# EAGLE design TeensyAmp_R4.2b (EAGLE 9.6.2)

## Sheet 1 of 3
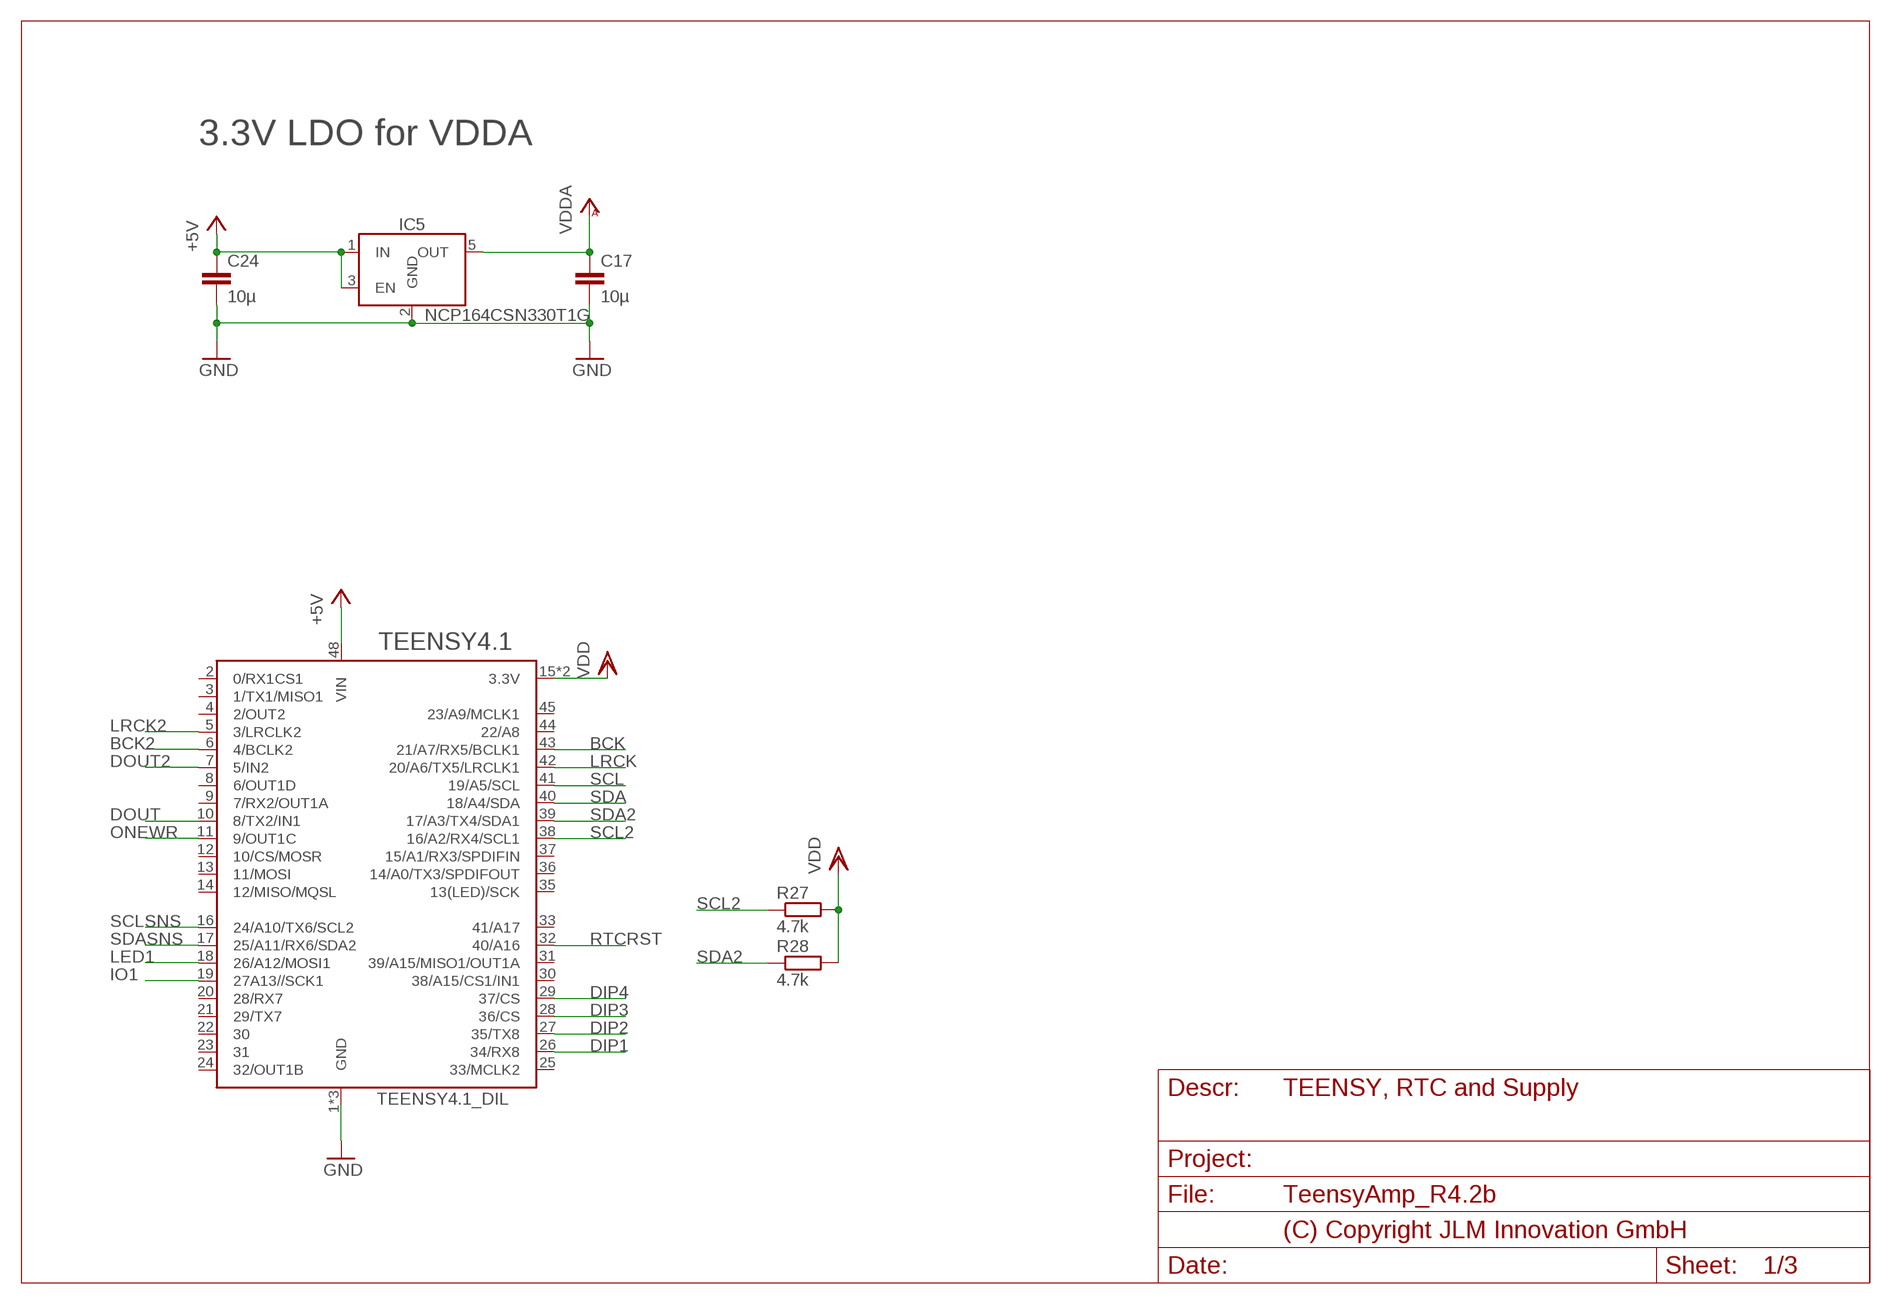
[diagram p0: schematic, sheet 1]
FRAME2 (DINA4_L): PAGE_DESCRIPTION: TEENSY, RTC and Supply

### Parts
C17  10µ  C-EUC0603  [C0603]
C24  10µ  C-EUC0603  [C0603]
IC5  NCP164CSN330T1G  LDO_ENSOT23-5  [SOT23-5]
R27  4.7k  R_JLMR0603  [R0603]
R28  4.7k  R_JLMR0603  [R0603]
TEENSY4.1  TEENSY4.1_DIL  [TEENSY4.1_DIL]

### Nets
+5V: C24.1 IC5.1(IN) IC5.3(EN) TEENSY4.1.48(VIN)
BCK: TEENSY4.1.43(21/A7/RX5/BCLK1)
BCK2: TEENSY4.1.6(4/BCLK2) ; also sheet 2,3
DIP1: TEENSY4.1.26(34/RX8)
DIP2: TEENSY4.1.27(35/TX8)
DIP3: TEENSY4.1.28(36/CS)
DIP4: TEENSY4.1.29(37/CS)
DOUT: TEENSY4.1.10(8/TX2/IN1)
DOUT2: TEENSY4.1.7(5/IN2) ; also sheet 2,3
GND: C17.2 C24.2 IC5.2(GND) TEENSY4.1.1(GND) TEENSY4.1.34(GND) TEENSY4.1.47(GND) ; also sheet 2,3
IO1: TEENSY4.1.19(27A13//SCK1)
LED1: TEENSY4.1.18(26/A12/MOSI1)
LRCK: TEENSY4.1.42(20/A6/TX5/LRCLK1)
LRCK2: TEENSY4.1.5(3/LRCLK2) ; also sheet 2,3
ONEWR: TEENSY4.1.11(9/OUT1C)
RTCRST: TEENSY4.1.32(40/A16)
SCL: TEENSY4.1.41(19/A5/SCL)
SCL2: R27.1 TEENSY4.1.38(16/A2/RX4/SCL1) ; also sheet 2,3
SCLSNS: TEENSY4.1.16(24/A10/TX6/SCL2)
SDA: TEENSY4.1.40(18/A4/SDA)
SDA2: R28.1 TEENSY4.1.39(17/A3/TX4/SDA1) ; also sheet 2,3
SDASNS: TEENSY4.1.17(25/A11/RX6/SDA2)
VDD: R27.2 R28.2 TEENSY4.1.15(3.3V) TEENSY4.1.46(3.3V) ; also sheet 2,3
VDDA: C17.1 IC5.5(OUT) ; also sheet 2,3
Unconnected: TEENSY4.1.2(0/RX1CS1) TEENSY4.1.3(1/TX1/MISO1) TEENSY4.1.4(2/OUT2) TEENSY4.1.8(6/OUT1D) TEENSY4.1.9(7/RX2/OUT1A) TEENSY4.1.12(10/CS/MOSR) TEENSY4.1.13(11/MOSI) TEENSY4.1.14(12/MISO/MQSL) TEENSY4.1.20(28/RX7) TEENSY4.1.21(29/TX7) TEENSY4.1.22 TEENSY4.1.23 TEENSY4.1.24(32/OUT1B) TEENSY4.1.25(33/MCLK2) TEENSY4.1.30(38/A15/CS1/IN1) TEENSY4.1.31(39/A15/MISO1/OUT1A) TEENSY4.1.33(41/A17) TEENSY4.1.35(13(LED)/SCK) TEENSY4.1.36(14/A0/TX3/SPDIFOUT) TEENSY4.1.37(15/A1/RX3/SPDIFIN) TEENSY4.1.44(22/A8) TEENSY4.1.45(23/A9/MCLK1)

### Notes on the sheet
- 3.3V LDO for VDDA

## Sheet 2 of 3
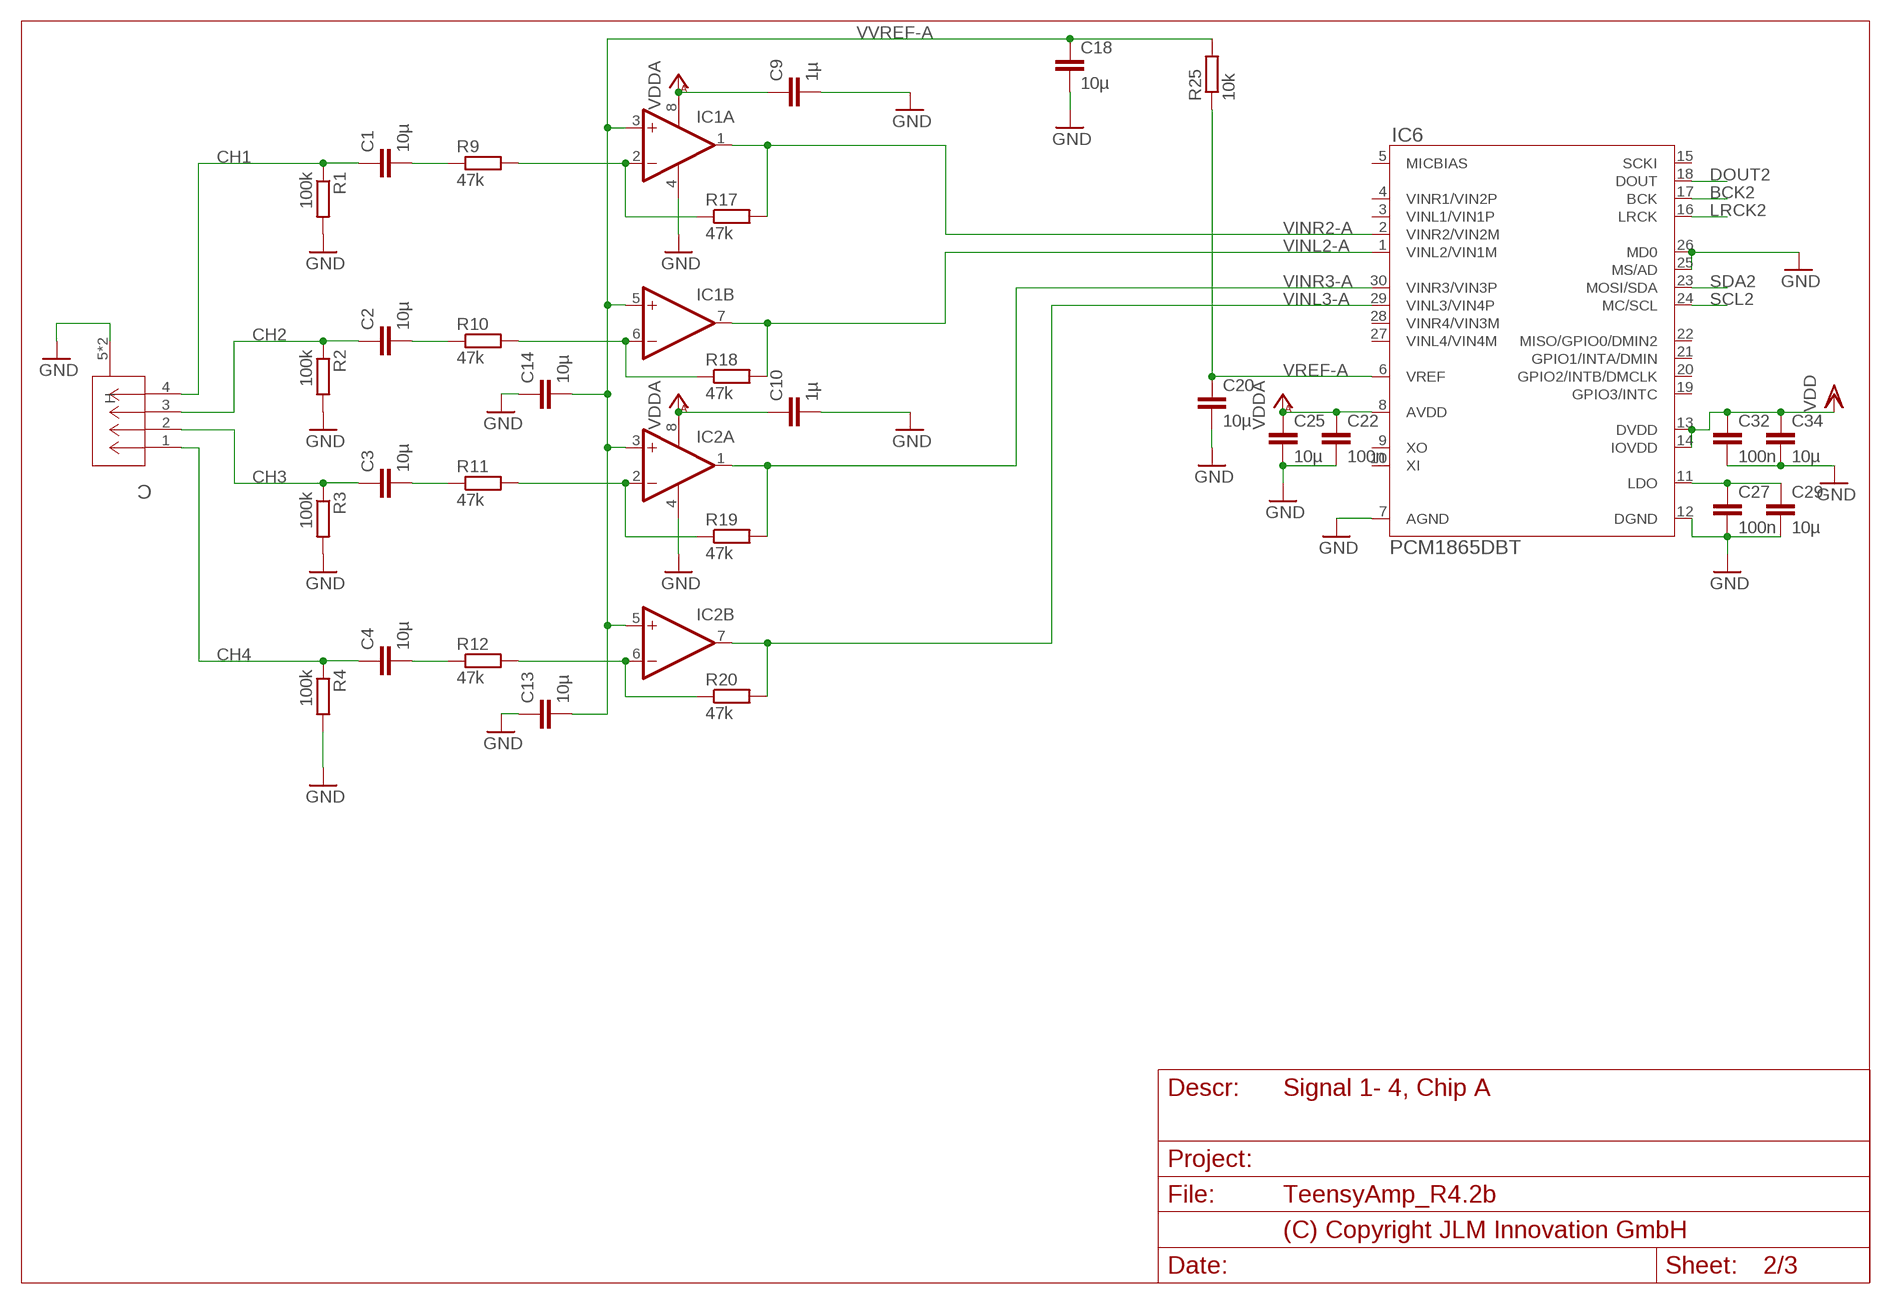
[diagram p1: schematic, sheet 2]
FRAME1 (DINA4_L): PAGE_DESCRIPTION: Signal 1- 4, Chip A

### Parts
C  5055670471  [CONN04_5055670471_MOL]
C1  10µ  C-EUC0805  [C0805]
C2  10µ  C-EUC0805  [C0805]
C3  10µ  C-EUC0805  [C0805]
C4  10µ  C-EUC0805  [C0805]
C9  1µ  C-EUC0603  [C0603]
C10  1µ  C-EUC0603  [C0603]
C13  10µ  C-EUC0603  [C0603]
C14  10µ  C-EUC0603  [C0603]
C18  10µ  C-EUC0603  [C0603]
C20  10µ  C-EUC0603  [C0603]
C22  100n  C-EUC0603  [C0603]
C25  10µ  C-EUC0603  [C0603]
C27  100n  C-EUC0603  [C0603]
C29  10µ  C-EUC0603  [C0603]
C32  100n  C-EUC0603  [C0603]
C34  10µ  C-EUC0603  [C0603]
IC1  OPA2344E  [MSOP08]
IC2  OPA2344E  [MSOP08]
IC6  PCM1865DBT  [SOP50P640X120-30N]
R1  100k  R_JLMR0603  [R0603]
R2  100k  R_JLMR0603  [R0603]
R3  100k  R_JLMR0603  [R0603]
R4  100k  R_JLMR0603  [R0603]
R9  47k  R_JLMR0603  [R0603]
R10  47k  R_JLMR0603  [R0603]
R11  47k  R_JLMR0603  [R0603]
R12  47k  R_JLMR0603  [R0603]
R17  47k  R_JLMR0603  [R0603]
R18  47k  R_JLMR0603  [R0603]
R19  47k  R_JLMR0603  [R0603]
R20  47k  R_JLMR0603  [R0603]
R25  10k  R_JLMR0603  [R0603]

### Nets
BCK2: IC6.17(BCK) ; also sheet 1,3
CH1: C1.1 C.4 R1.1
CH2: C2.1 C.3 R2.1
CH3: C3.1 C.2 R3.1
CH4: C4.1 C.1 R4.1
DOUT2: IC6.18(DOUT) ; also sheet 1,3
GND: C9.2 C10.2 C13.1 C14.1 C18.2 C20.2 C22.2 C25.2 C27.2 C29.2 C32.2 C34.2 C.5(H) C.6(H) IC1.4(A:V-) IC2.4(A:V-) IC6.7(AGND) IC6.12(DGND) IC6.25(MS/AD) IC6.26(MD0) R1.2 R2.2 R3.2 R4.2 ; also sheet 1,3
LRCK2: IC6.16(LRCK) ; also sheet 1,3
N$11: C27.1 C29.1 IC6.11(LDO)
N$23: C2.2 R10.1
N$24: C3.2 R11.1
N$25: C1.2 R9.1
N$26: C4.2 R12.1
N$31: IC1.2(A:-IN) R9.2 R17.1
N$32: IC1.6(B:-IN) R10.2 R18.1
N$33: IC2.2(A:-IN) R11.2 R19.1
N$34: IC2.6(B:-IN) R12.2 R20.1
SCL2: IC6.24(MC/SCL) ; also sheet 1,3
SDA2: IC6.23(MOSI/SDA) ; also sheet 1,3
VDD: C32.1 C34.1 IC6.13(DVDD) IC6.14(IOVDD) ; also sheet 1,3
VDDA: C9.1 C10.1 C22.1 C25.1 IC1.8(A:V+) IC2.8(A:V+) IC6.8(AVDD) ; also sheet 1,3
VINL2-A: IC1.7(B:OUT) IC6.1(VINL2/VIN1M) R18.2
VINL3-A: IC2.7(B:OUT) IC6.29(VINL3/VIN4P) R20.2
VINR2-A: IC1.1(A:OUT) IC6.2(VINR2/VIN2M) R17.2
VINR3-A: IC2.1(A:OUT) IC6.30(VINR3/VIN3P) R19.2
VREF-A: C20.1 IC6.6(VREF) R25.1
VVREF-A: C13.2 C14.2 C18.1 IC1.3(A:+IN) IC1.5(B:+IN) IC2.3(A:+IN) IC2.5(B:+IN) R25.2
Unconnected: IC6.3(VINL1/VIN1P) IC6.4(VINR1/VIN2P) IC6.5(MICBIAS) IC6.9(XO) IC6.10(XI) IC6.15(SCKI) IC6.19(GPIO3/INTC) IC6.20(GPIO2/INTB/DMCLK) IC6.21(GPIO1/INTA/DMIN) IC6.22(MISO/GPIO0/DMIN2) IC6.27(VINL4/VIN4M) IC6.28(VINR4/VIN3M)

## Sheet 3 of 3
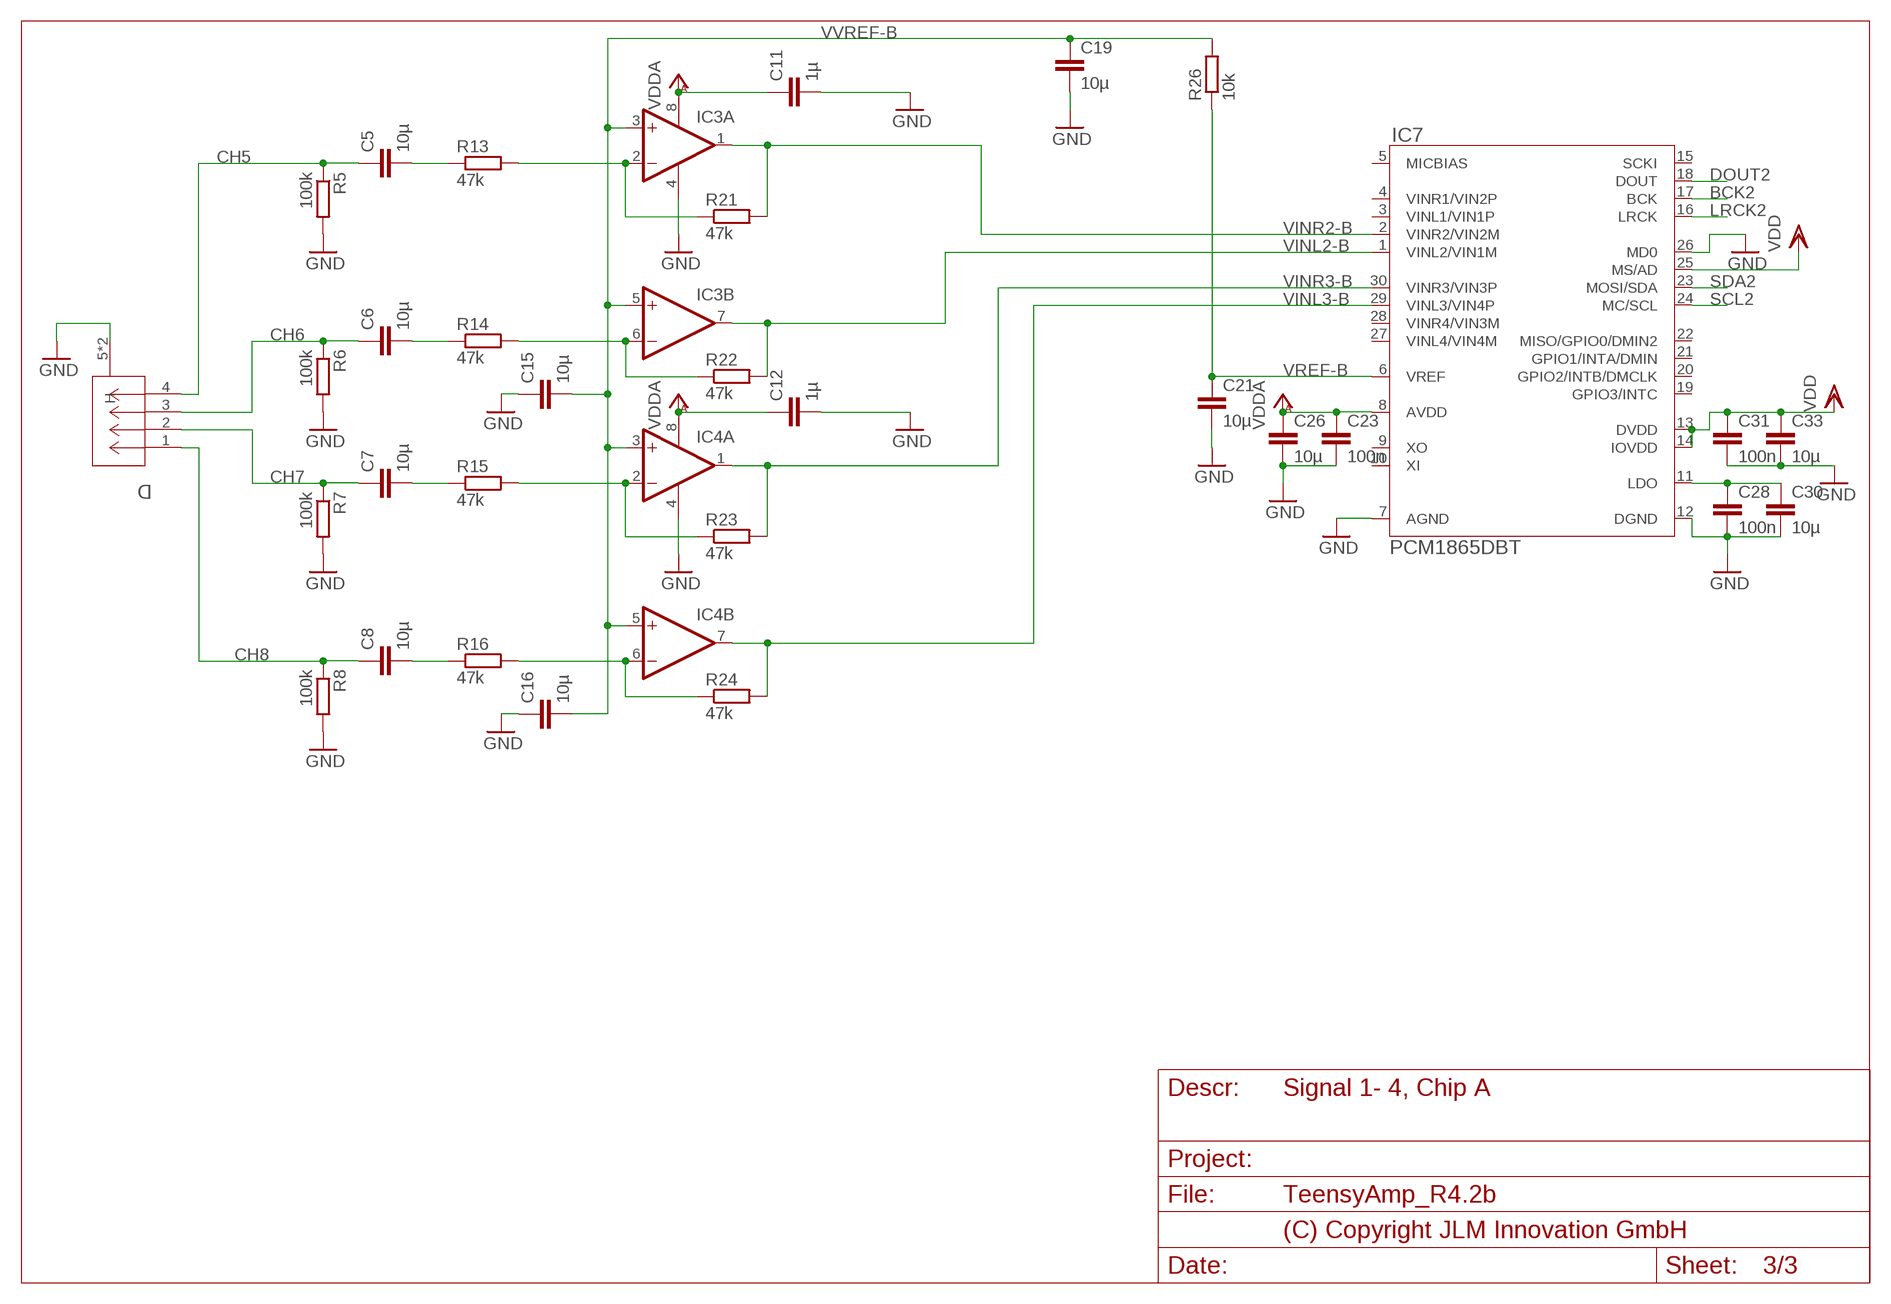
[diagram p2: schematic, sheet 3]
FRAME3 (DINA4_L): PAGE_DESCRIPTION: Signal 1- 4, Chip A

### Parts
C5  10µ  C-EUC0805  [C0805]
C6  10µ  C-EUC0805  [C0805]
C7  10µ  C-EUC0805  [C0805]
C8  10µ  C-EUC0805  [C0805]
C11  1µ  C-EUC0603  [C0603]
C12  1µ  C-EUC0603  [C0603]
C15  10µ  C-EUC0603  [C0603]
C16  10µ  C-EUC0603  [C0603]
C19  10µ  C-EUC0603  [C0603]
C21  10µ  C-EUC0603  [C0603]
C23  100n  C-EUC0603  [C0603]
C26  10µ  C-EUC0603  [C0603]
C28  100n  C-EUC0603  [C0603]
C30  10µ  C-EUC0603  [C0603]
C31  100n  C-EUC0603  [C0603]
C33  10µ  C-EUC0603  [C0603]
D  5055670471  [CONN04_5055670471_MOL]
IC3  OPA2344E  [MSOP08]
IC4  OPA2344E  [MSOP08]
IC7  PCM1865DBT  [SOP50P640X120-30N]
R5  100k  R_JLMR0603  [R0603]
R6  100k  R_JLMR0603  [R0603]
R7  100k  R_JLMR0603  [R0603]
R8  100k  R_JLMR0603  [R0603]
R13  47k  R_JLMR0603  [R0603]
R14  47k  R_JLMR0603  [R0603]
R15  47k  R_JLMR0603  [R0603]
R16  47k  R_JLMR0603  [R0603]
R21  47k  R_JLMR0603  [R0603]
R22  47k  R_JLMR0603  [R0603]
R23  47k  R_JLMR0603  [R0603]
R24  47k  R_JLMR0603  [R0603]
R26  10k  R_JLMR0603  [R0603]

### Nets
BCK2: IC7.17(BCK) ; also sheet 1,2
CH5: C5.1 D.4 R5.1
CH6: C6.1 D.3 R6.1
CH7: C7.1 D.2 R7.1
CH8: C8.1 D.1 R8.1
DOUT2: IC7.18(DOUT) ; also sheet 1,2
GND: C11.2 C12.2 C15.1 C16.1 C19.2 C21.2 C23.2 C26.2 C28.2 C30.2 C31.2 C33.2 D.5(H) D.6(H) IC3.4(A:V-) IC4.4(A:V-) IC7.7(AGND) IC7.12(DGND) IC7.26(MD0) R5.2 R6.2 R7.2 R8.2 ; also sheet 1,2
LRCK2: IC7.16(LRCK) ; also sheet 1,2
N$43: C28.1 C30.1 IC7.11(LDO)
N$48: IC3.2(A:-IN) R13.2 R21.1
N$49: IC3.6(B:-IN) R14.2 R22.1
N$50: IC4.2(A:-IN) R15.2 R23.1
N$51: IC4.6(B:-IN) R16.2 R24.1
N$52: C6.2 R14.1
N$53: C7.2 R15.1
N$54: C8.2 R16.1
N$55: C5.2 R13.1
SCL2: IC7.24(MC/SCL) ; also sheet 1,2
SDA2: IC7.23(MOSI/SDA) ; also sheet 1,2
VDD: C31.1 C33.1 IC7.13(DVDD) IC7.14(IOVDD) IC7.25(MS/AD) ; also sheet 1,2
VDDA: C11.1 C12.1 C23.1 C26.1 IC3.8(A:V+) IC4.8(A:V+) IC7.8(AVDD) ; also sheet 1,2
VINL2-B: IC3.7(B:OUT) IC7.1(VINL2/VIN1M) R22.2
VINL3-B: IC4.7(B:OUT) IC7.29(VINL3/VIN4P) R24.2
VINR2-B: IC3.1(A:OUT) IC7.2(VINR2/VIN2M) R21.2
VINR3-B: IC4.1(A:OUT) IC7.30(VINR3/VIN3P) R23.2
VREF-B: C21.1 IC7.6(VREF) R26.1
VVREF-B: C15.2 C16.2 C19.1 IC3.3(A:+IN) IC3.5(B:+IN) IC4.3(A:+IN) IC4.5(B:+IN) R26.2
Unconnected: IC7.3(VINL1/VIN1P) IC7.4(VINR1/VIN2P) IC7.5(MICBIAS) IC7.9(XO) IC7.10(XI) IC7.15(SCKI) IC7.19(GPIO3/INTC) IC7.20(GPIO2/INTB/DMCLK) IC7.21(GPIO1/INTA/DMIN) IC7.22(MISO/GPIO0/DMIN2) IC7.27(VINL4/VIN4M) IC7.28(VINR4/VIN3M)

## Library data of the parts
C D = teensyamp:5055670471: molex micro-lock plus horizontal header 4 pins; COPYRIGHT: Copyright (C) 2025 Ultra Librarian. All rights reserved.; MANUFACTURER_PART_NUMBER: 5055670471; MFR_NAME: Molex Connector Corporation
C1-C34 = jlm_cap:C-EU: CAPACITOR, European symbol
IC1-IC4 = jlm_linear:OPA2*: Dual Operational Amplifier Low Power, Single-Supply, Rail-To-Rail Operational Amplifier Source: http://focus.ti.com/lit/ds/symlink/opa2345.pdf http://focus.ti.com .. opa241.pdf http://focus.ti.com/lit/ds/symlink/opa2134.pdf
IC5 = jlm_power:LDO_EN; OC_FARNELL: 3367831; OC_MOUSER: 863-NCP164CSN330T1G
IC6 IC7 = jlm_adc_dac:PCM1865: PCM1865 4-Channel, 192-kHz, Audio ADCs; OC_MOUSER: 595-PCM1865DBT
R1-R28 = jlm_resistors:R_JLM: RESISTOR, European symbol
TEENSY4.1 = jlm_micro:TEENSY4.1_DIL

## Net classes
0 default: clearance 0.205 mm

## Board
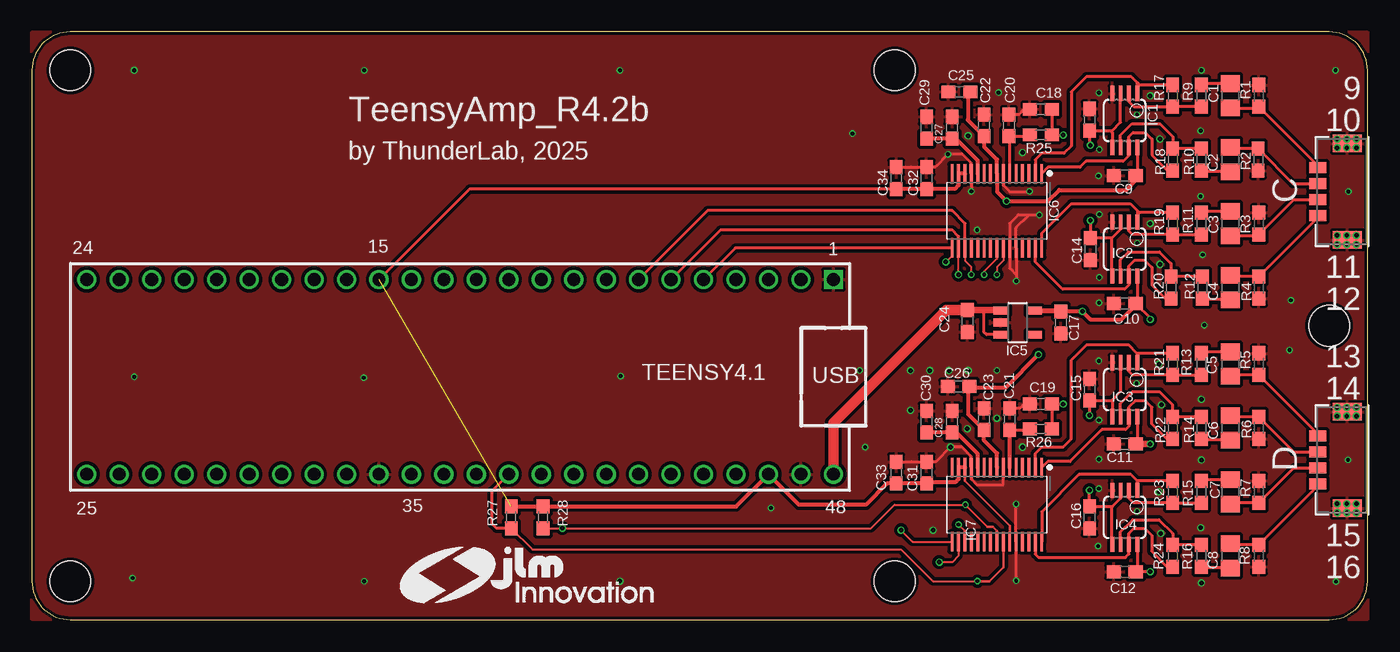
[diagram p3: board, top side]
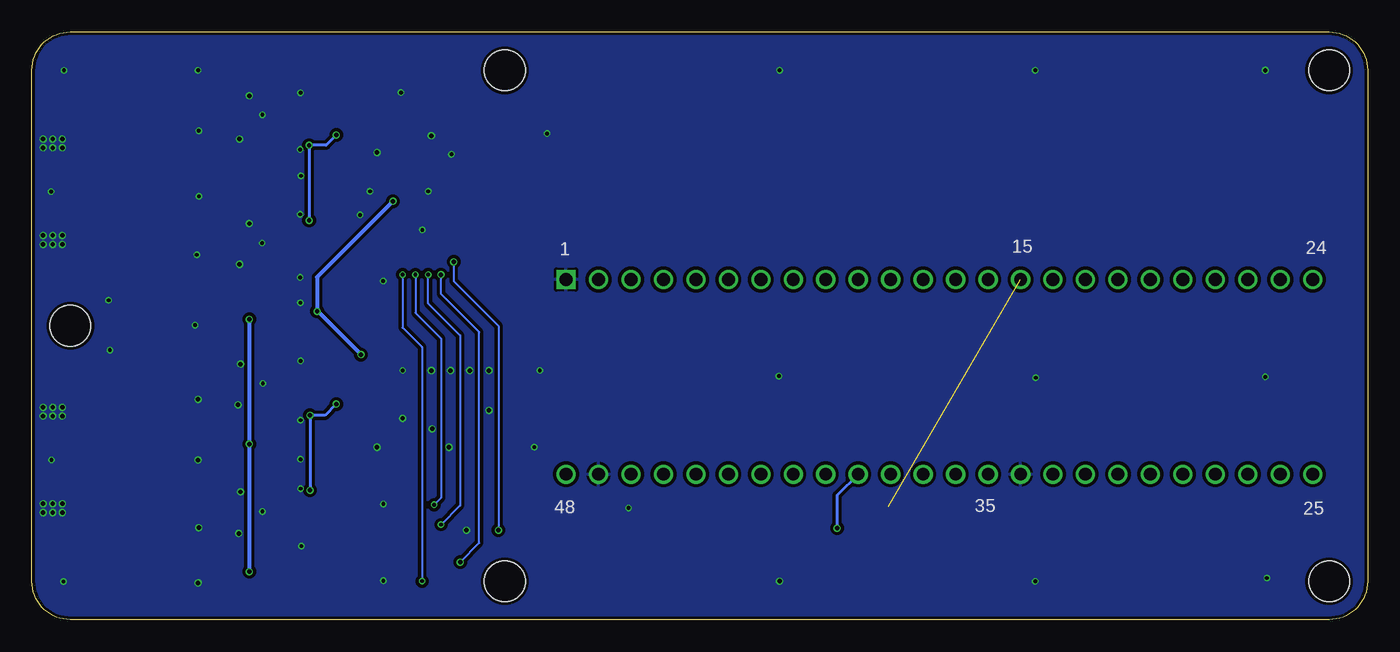
[diagram p4: board, bottom side, seen from below]

Size 104.5 x 46 mm. Coordinates in mm from the lower left corner, seen from the top.
Outline: 50.5,0 3,0 arc-90 0,3 0,43 arc-90 3,46 101.5,46 arc-90 104.5,43 104.5,3 arc-90 101.5,0 64.5,0
Outline: 50.5,0 50.59,0
Outline: 64.41,0 64.5,0
Outline: 50.5,0 64.5,0
Copper layers (1*16): Top 0.018mm / dielectric 1.55mm / Bottom 0.018mm
Design rules "Multi-CB_2L_100цm-Tracks_OL35цm *": minimum track width 0.1mm, minimum drill 0.2mm, track to track 0.1mm, track to pad 0.1mm, pad to pad 0.1mm, via to via 0.1mm, smd to smd 0mil, copper to edge 0.2mm, drill to drill 0.2mm, minimum pad ring 0.125mm, minimum via ring 0.1mm, stop-mask expansion 2mil, vias tented up to drill 0mil, thermal gap 0.2mm
Holes 3.2 mm at 3,3 67.5,3 3,43 67.5,43 101.5,23

### Footprints (pad centres in the part's own frame; a part is rotated, then mirrored left to right if it is on the bottom)
CONN04_5055670471_MOL = smd 0.838 x 1.295: 1 1.875,-1.894; 2 0.625,-1.894; 3 -0.625,-1.894; 4 -1.875,-1.894 | smd 1.397 x 2.261: 5 -3.775,0.401; 6 3.775,0.401
C0805 = smd 1.3 x 1.5: 1 -0.95,0; 2 0.95,0
C0603 = smd 1.1 x 1: 1 -0.85,0; 2 0.85,0
MSOP08 = smd 0.3 x 1.2: 1 -0.976,-2.113; 2 -0.326,-2.113; 3 0.324,-2.113; 4 0.974,-2.113; 5 0.974,2.112; 6 0.324,2.112; 7 -0.326,2.112; 8 -0.976,2.112
SOT23-5 = smd 0.6 x 1.2: 1 -0.95,-1.306; 2 0,-1.306; 3 0.95,-1.306; 4 0.95,1.306; 5 -0.95,1.306
SOP50P640X120-30N = smd 1.5 x 0.28: 1 -2.9,3.5; 2 -2.9,3; 3 -2.9,2.5; 4 -2.9,2; 5 -2.9,1.5; 6 -2.9,1; 7 -2.9,0.5; 8 -2.9,0; 9 -2.9,-0.5; 10 -2.9,-1; 11 -2.9,-1.5; 12 -2.9,-2; 13 -2.9,-2.5; 14 -2.9,-3; 15 -2.9,-3.5; 16 2.9,-3.5; 17 2.9,-3; 18 2.9,-2.5; 19 2.9,-2; 20 2.9,-1.5; 21 2.9,-1; 22 2.9,-0.5; 23 2.9,0; 24 2.9,0.5; 25 2.9,1; 26 2.9,1.5; 27 2.9,2; 28 2.9,2.5; 29 2.9,3; 30 2.9,3.5
R0603 = smd 1.1 x 1: 1 -0.85,0; 2 0.85,0
TEENSY4.1_DIL = drill 1 square: 1 -29.21,-7.62 | drill 1: 2 -26.67,-7.62; 3 -24.13,-7.62; 4 -21.59,-7.62; 5 -19.05,-7.62; 6 -16.51,-7.62; 7 -13.97,-7.62; 8 -11.43,-7.62; 9 -8.89,-7.62; 10 -6.35,-7.62; 11 -3.81,-7.62; 12 -1.27,-7.62; 13 1.27,-7.62; 14 3.81,-7.62; 15 6.35,-7.62; 16 8.89,-7.62; 17 11.43,-7.62; 18 13.97,-7.62; 19 16.51,-7.62; 20 19.05,-7.62; 21 21.59,-7.62; 22 24.13,-7.62; 23 26.67,-7.62; 24 29.21,-7.62; 25 29.21,7.62; 26 26.67,7.62; 27 24.13,7.62; 28 21.59,7.62; 29 19.05,7.62; 30 16.51,7.62; 31 13.97,7.62; 32 11.43,7.62; 33 8.89,7.62; 34 6.35,7.62; 35 3.81,7.62; 36 1.27,7.62; 37 -1.27,7.62; 38 -3.81,7.62; 39 -6.35,7.62; 40 -8.89,7.62; 41 -11.43,7.62; 42 -13.97,7.62; 43 -16.51,7.62; 44 -19.05,7.62; 45 -21.59,7.62; 46 -24.13,7.62; 47 -26.67,7.62; 48 -29.21,7.62

### Placement (x,y rotation side)
C  102.5,33.5 270 top
C1  93.75,41 90 top
C2  93.75,36 270 top
C3  93.75,31 90 top
C4  93.75,26 270 top
C5  93.75,20 90 top
C6  93.75,15 270 top
C7  93.75,10 90 top
C8  93.75,5 270 top
C9  85.5,34.75 180 top
C10  85.5,24.75 180 top
C11  85.5,13.75 180 top
C12  85.5,3.75 180 top
C13  82.75,39.12 270 top
C14  82.81,29 90 top
C15  82.75,18 270 top
C16  82.75,8 90 top
C17  80.5,23.25 270 top
C18  78.94,39.94 180 top
C19  78.94,16.88 180 top
C20  76.44,38.69 90 top
C21  76.5,15.69 90 top
C22  74.5,38.69 90 top
C23  74.5,15.69 90 top
C24  73.19,23.38 270 top
C25  72.56,41.31 180 top
C26  72.5,18.25 180 top
C27  72,38.5 90 top
C28  72,15.5 90 top
C29  70,38.5 90 top
C30  70,15.5 90 top
C31  70,11.5 90 top
C32  70,34.56 90 top
C33  67.62,11.5 90 top
C34  67.62,34.56 90 top
D  102.5,12.5 270 top
IC1  85.5,39.06 180 top
IC2  85.5,29 180 top
IC3  85.5,18 180 top
IC4  85.5,8 180 top
IC5  77.12,23.25 270 top
IC6  75.5,32 270 top
IC7  75.5,9 270 top
R1  96,41 90 top
R2  95.94,36 270 top
R3  96,31 90 top
R4  96,26 270 top
R5  96,20 90 top
R6  96,15 270 top
R7  96,10 90 top
R8  96,5 270 top
R9  91.5,41 270 top
R10  91.5,36 90 top
R11  91.5,31 270 top
R12  91.56,26 90 top
R13  91.5,20 270 top
R14  91.5,15 90 top
R15  91.5,10 270 top
R16  91.5,5 90 top
R17  89.25,41 90 top
R18  89.25,36 270 top
R19  89.25,31 90 top
R20  89.12,26 270 top
R21  89.25,20 90 top
R22  89.25,15 270 top
R23  89.25,10 90 top
R24  89.25,5 270 top
R25  78.94,37.94 0 top
R26  78.94,14.94 0 top
R27  37.5,8 90 top
R28  40,8 90 top
TEENSY4.1  33.5,19 180 top
U$1  [JLM_LOGO_MID]  28.5,1 0 top

### Tracks (layer width: path | path; a pad name or v marks a point on that pad's centre or on a via)
+5V
  Top 0.254: IC5.3 74.7,22.3 74.5,22.5 74.5,24.23
  Top 0.508: C24.1 74.5,24.23 75.79,24.23 IC5.1
  Top 0.813: TEENSY4.1.48 62.71,15.38 71.56,24.23 C24.1
BCK2  (via drill 0.35)
  Top 0.152: IC7.17 72.5,5 72,4.5 v71,4.5 | v72.5,27 IC6.17
  Top 0.254: IC6.17 72.5,30 72,30.5 53.89,30.5 TEENSY4.1.6
  Bottom 0.152: v71,4.5 69.5,6 69.5,22.5 72.5,25.5 v72.5,27
CH1
  Top 0.254: C1.1 95.9,40.05 R1.1 100.61,35.54 C.4
CH2
  Top 0.254: C.3 98.66,34.12 R2.1 93.85,36.85 C2.1
CH3
  Top 0.254: C3.1 95.9,30.05 R3.1 98.72,32.88 C.2
CH4
  Top 0.254: C4.1 93.85,26.85 R4.1 100.61,31.46 C.1
CH5
  Top 0.254: C5.1 93.85,19.15 R5.1 100.61,14.54 D.4
CH6
  Top 0.254: C6.1 93.85,15.85 R6.1 98.72,13.12 D.3
CH7
  Top 0.254: C7.1 93.85,9.15 R7.1 98.72,11.88 D.2
CH8
  Top 0.254: C8.1 93.85,5.85 R8.1 100.61,10.46 D.1
DOUT2  (via drill 0.3)
  Top 0.152: v73.5,27 73.5,27.6 73,28.1 IC6.18
  Top 0.2: IC7.18 73,6.94 v72.5,7.44
  Top 0.254: IC6.18 73,31 72,32 52.85,32 TEENSY4.1.7
  Bottom 0.152: v72.5,7.44 71,8.94 71,22.25 73.5,24.75 v73.5,27
GND  (via drill 0.3, 0.35)
  Top 0.152: 78.03,33.5 v78.05,33.52 | 77.01,26.99 v77.01,26.5
  Top 0.254: IC7.7 76,10.55 73.95,10.55 73.5,11 IC7.12 73.48,11.92 73.48,12.76 72.74,13.5 v71.88,13.5 70.72,12.35 C31.2 68.85,12.35 68.81,12.31 68.78,12.35 C33.2 | IC6.7 76,34 76.5,33.5 78.03,33.5 | v73.5,33.52 73.52,33.54 73.52,34.88 IC6.12 73.48,34.92 73.48,35.76 72.82,36.42 v71.67,36.42 70.67,35.42 70.01,35.42 | v77.01,26.5 77.01,29.09 IC6.26 77,30.68 78,31.68 | v78.83,31.68 78,31.68 | 78,31.68 77.17,31.68 76.5,31 IC6.25 76.5,27.5 77.01,26.99 | v77,9.05 IC7.26 v77,3.05 | C32.2 70.01,35.42 | C34.2 68.75,35.41 68.76,35.42 70.01,35.42 | C18.2 77.62,39.94 77.22,39.54 C20.2 | C19.2 77.62,16.88 77.29,16.54 C21.2
  other vias: 83.49,15.61 83.47,10.25 86.46,8.46 26,43 8,19 91.5,43 7.88,3.25 46,43 65.2,13.5 73.95,30.5 75.62,41.25 83.49,12.55 86.46,39.51 86.49,29.48 91.44,33.12 103,33.5 98.4,21.1 91.6,28.55 91.45,38.26 102.04,2.98 102,43 98.5,25 102.97,12.5 46.06,19.06 86.42,18.49 83.5,24.8 75.5,19.5 64.2,38.05 25.96,18.94 83.51,36.8 83.49,41.24 83.51,31.73 83.45,34.74 83.51,26.79 57.83,8.74 26,3 83.41,5.75 83.47,20.25 64.76,19.5 91.72,23.05 91.5,12.5 91.44,7.19 91.5,2.88 91.5,17.25 46,3 87.5,41 77.5,36.56 77.5,13.5 88.31,6.75 88.38,16.81 88.25,27.81 88.25,37.62 102.12,37.62 103.62,37.62 102.88,37.62 102.12,36.94 102.88,36.94 103.62,36.94 102.12,30.06 103.62,30.06 102.88,30.06 102.12,29.38 102.88,29.38 103.62,29.38 102.12,16.62 103.62,16.62 102.88,16.62 102.12,15.94 102.88,15.94 103.62,15.94 102.12,9.06 103.62,9.06 102.88,9.06 102.12,8.38 102.88,8.38 103.62,8.38 73.25,19.5 71.75,19.5 70.25,19.5 68.75,19.5 70.5,7 8,43 87.5,31 88.19,20 88.19,10 68.75,16.38 73.25,37.88 73.19,14.94 75.5,15.75
  pour Top (isolate 0.254, rank 3): 0,0 0,46 104.5,46 104.5,0
  pour Bottom (isolate 0.254): 0,0 0,46 104.5,46 104.5,0
LRCK2  (via drill 0.35)
  Top 0.152: IC6.16 72,28.5 v71.5,28 | v68,7 68.9,6.1 IC7.16
  Top 0.254: IC6.16 55.03,29.1 TEENSY4.1.5
  Bottom 0.152: v71.5,28 71.5,26.5 68,23 v68,7
N$11
  Top 0.305: IC6.11 74,35.94 72.29,37.65 C27.1 C29.1
N$23
  Top 0.254: C2.2 91.6,35.05 R10.1
N$24
  Top 0.254: R11.1 91.6,31.95 C3.2
N$25
  Top 0.254: C1.2 91.6,41.95 R9.1
N$26
  Top 0.254: C4.2 91.66,25.05 R12.1
N$31
  Top 0.254: R9.2 R17.1 86.22,40.15 85.83,40.55 IC1.2
N$32
  Top 0.254: IC1.6 85.18,37.93 86.06,38.81 88.25,38.81 89.25,37.81 R18.1 R10.2
N$33
  Top 0.254: R11.2 R19.1 86.1,30.15 85.83,30.42 IC2.2
N$34
  Top 0.254: IC2.6 85.18,28.18 85.78,28.78 88.22,28.78 89.12,27.88 R20.1 R12.2
N$43
  Top 0.305: IC7.11 74,12.96 72.31,14.65 C28.1 C30.1
N$48
  Top 0.254: IC3.2 85.83,19.42 86.1,19.15 R21.1 R13.2
N$49
  Top 0.254: IC3.6 85.18,16.93 86.06,17.81 88.25,17.81 89.25,16.81 R22.1 R14.2
N$50
  Top 0.254: IC4.2 85.83,9.49 86.16,9.15 R23.1 R15.2
N$51
  Top 0.254: IC4.6 85.18,6.86 86.12,7.81 88.19,7.81 89.25,6.75 R24.1 R16.2
N$52
  Top 0.254: C6.2 91.6,14.05 R14.1
N$53
  Top 0.254: C7.2 91.6,10.95 R15.1
N$54
  Top 0.254: C8.2 91.6,4.05 R16.1
N$55
  Top 0.254: C5.2 91.6,20.95 R13.1
SCL2  (via drill 0.3)
  Top 0.152: v75.5,27 75.5,27.6 76,28.1 IC6.24 | v73.97,3.01 v73.96,3 70.5,3 68,5.5 39.15,5.5 R27.1
  Top 0.2: IC7.24 76,4.1 74.91,3.01 v73.97,3.01
  Top 0.254: R27.1 36.35,7.15 36,7.5 36,10.07 TEENSY4.1.38
  Bottom 0.152: v75.5,27 75.5,22.85 73.97,21.32 v73.97,3.01
SDA2  (via drill 0.3, 0.35)
  Top 0.152: v74.5,27 74.5,27.25 75.5,28.25 IC6.23 | R28.1 v41.5,7.15 65.65,7.15 67.49,8.99 v73.04,8.99
  Top 0.2: v73.04,8.99 74.77,7.26 75.18,7.26 75.5,6.93 IC7.23
  Bottom 0.152: v74.5,27 74.5,24 72.5,22 72.5,9.53 v73.04,8.99
  Bottom 0.254: TEENSY4.1.39 41.5,9.73 v41.5,7.15
VDD  (1 unrouted)
  Top 0.2: IC7.13 73,10.85 76.5,7.35 IC7.25
  Top 0.254: C34.1 34.24,33.71 TEENSY4.1.15
  Top 0.305: IC6.13 IC6.14 72.5,34 72.21,33.71 C32.1 C34.1 | IC7.13 IC7.14 72.5,11 72.25,10.75 70.2,10.75 C31.1 C33.1 66.9,10.65 65.25,9 60,9 TEENSY4.1.46 | TEENSY4.1.46 | TEENSY4.1.46 55.1,8.85 R28.2 R27.2
VDDA  (via drill 0.35)
  Top 0.254: IC1.8 86.48,34.75 | 86.48,34.75 86.48,34.5 | C9.1 86.48,34.75 | IC4.8 86.48,3.56 86.51,3.59 C12.1 v87.5,3.75 | IC3.8 86.48,13.88 C11.1 | IC2.8 86.48,24.88 C10.1 87.5,23.6 v87.5,23.5
  Top 0.305: 80.53,24.12 v82.19,24.12 82.81,23.5 85.25,23.5 86.35,24.6 | IC7.8 75.5,13.03 74.5,14.03 C23.1 73.25,16.09 73.25,18.15 C26.1 73.45,18.15 76.15,18.15 v78.75,20.75 | C25.1 73.22,41.12 73.22,39.11 C22.1 74.5,37.01 75.5,36.01 IC6.8 75.5,33.5 v76.25,32.75 79.5,32.75 80.39,33.63 85.61,33.63 86.48,34.5
  Top 0.406: IC5.5 80.4,24.2 C17.1 | C10.1 86.35,24.6
  Top 0.508: 80.53,24.12 C17.1 | C11.1 v87.5,13.75
  Bottom 0.305: v76.25,32.75 82.19,26.81 v82.19,24.12 82.12,24.12 v78.75,20.75 | v87.5,23.5 v87.5,13.75 v87.5,3.75
VINL2-A
  Top 0.254: R18.2 88.85,35.15 87.62,36.38 87.62,37.62 87.12,38.12 86.14,38.12 85.83,37.81 IC1.7 85.83,36.33 85.38,35.88 82.47,35.88 82,35.4 79.5,35.4 IC6.1
VINL2-B
  Top 0.254: IC7.1 79.47,12.38 81.22,12.38 83.72,14.88 85.57,14.88 85.83,15.13 IC3.7 85.83,16.64 86.31,17.12 87.12,17.12 87.62,16.62 87.62,15.31 88.79,14.15 R22.2
VINL3-A
  Top 0.254: IC6.29 78.5,28 80.62,25.88 85.5,25.88 85.83,26.2 IC2.7 85.83,27.68 86.28,28.13 87.05,28.13 87.62,27.56 87.62,26.19 88.66,25.15 R20.2
VINL3-B
  Top 0.254: R24.2 88.81,4.15 87.61,5.35 87.61,6.6 87.08,7.12 86.21,7.12 85.83,6.75 IC4.7 85.83,5.14 85.56,4.88 78.75,4.88 78.5,5.12 IC7.29
VINR2-A
  Top 0.254: IC1.1 86.48,42.02 | 86.48,42.02 86,42.5 82.5,42.5 81.31,41.31 81.31,37.06 80.75,36.5 79,36.5 78.5,36 IC6.2 | R17.2 86.65,41.85 86.48,42.02
VINR2-B
  Top 0.254: IC7.2 78.5,13 79,13.5 80.69,13.5 81.31,14.12 81.31,20.31 82.5,21.5 85.81,21.5 86.46,20.85 | IC3.1 86.48,20.84 86.46,20.85 | R21.2 86.46,20.85
VINR3-A
  Top 0.254: IC2.1 86.5,31.11 86.5,32 | IC6.30 79,30.25 81.31,32.56 85.94,32.56 86.5,32 | 86.5,32 86.65,31.85 R19.2
VINR3-B
  Top 0.254: IC7.30 79,8.44 81.92,11.36 85.99,11.36 86.5,10.85 | R23.2 86.5,10.85 | IC4.1 86.48,10.83 86.5,10.85
VREF-A
  Top 0.254: IC6.6 76.5,37.78 C20.1 77.99,37.84 R25.1
VREF-B
  Top 0.254: C21.1 77.99,14.84 R26.1
  Top 0.305: IC7.6 C21.1
VVREF-A  (via drill 0.35)
  Top 0.254: IC1.3 85.18,38.93 84.53,38.27 | C18.1 R25.2 v80.69,37.94 | v82.81,31.25 C14.2 84.48,29.85 | IC2.3 85.18,30.54 84.48,29.85 | 84.53,38.27 C13.2 82.75,37.19 v82.81,37.12 | 84.53,38.27 84.46,38.21 84.53,38.15 IC1.5 | IC2.5 84.48,26.93 84.48,29.85
  Bottom 0.254: v82.81,31.25 v82.81,37.12 81.5,37.12 v80.69,37.94
VVREF-B  (via drill 0.35)
  Top 0.254: IC3.3 85.18,17.85 84.47,17.15 | R26.2 C19.1 v80.69,16.88 | 84.47,17.15 C15.2 v82.75,16 | 84.5,8.85 84.54,8.85 85.18,9.49 IC4.3 | IC4.5 84.5,5.91 84.5,8.85 | 84.47,17.15 84.53,17.1 IC3.5 | 84.5,8.85 C16.2 v82.75,10.12
  Bottom 0.254: v82.75,10.12 v82.75,16 81.56,16 v80.69,16.88

### Text on the board
tNames: 9 | 10 | by ThunderLab, 2025 | 11 | 12 | 13 | 14 | USB | 15 | 16